# EAGLE design outputs_board_16_1_0 (EAGLE 5.07)
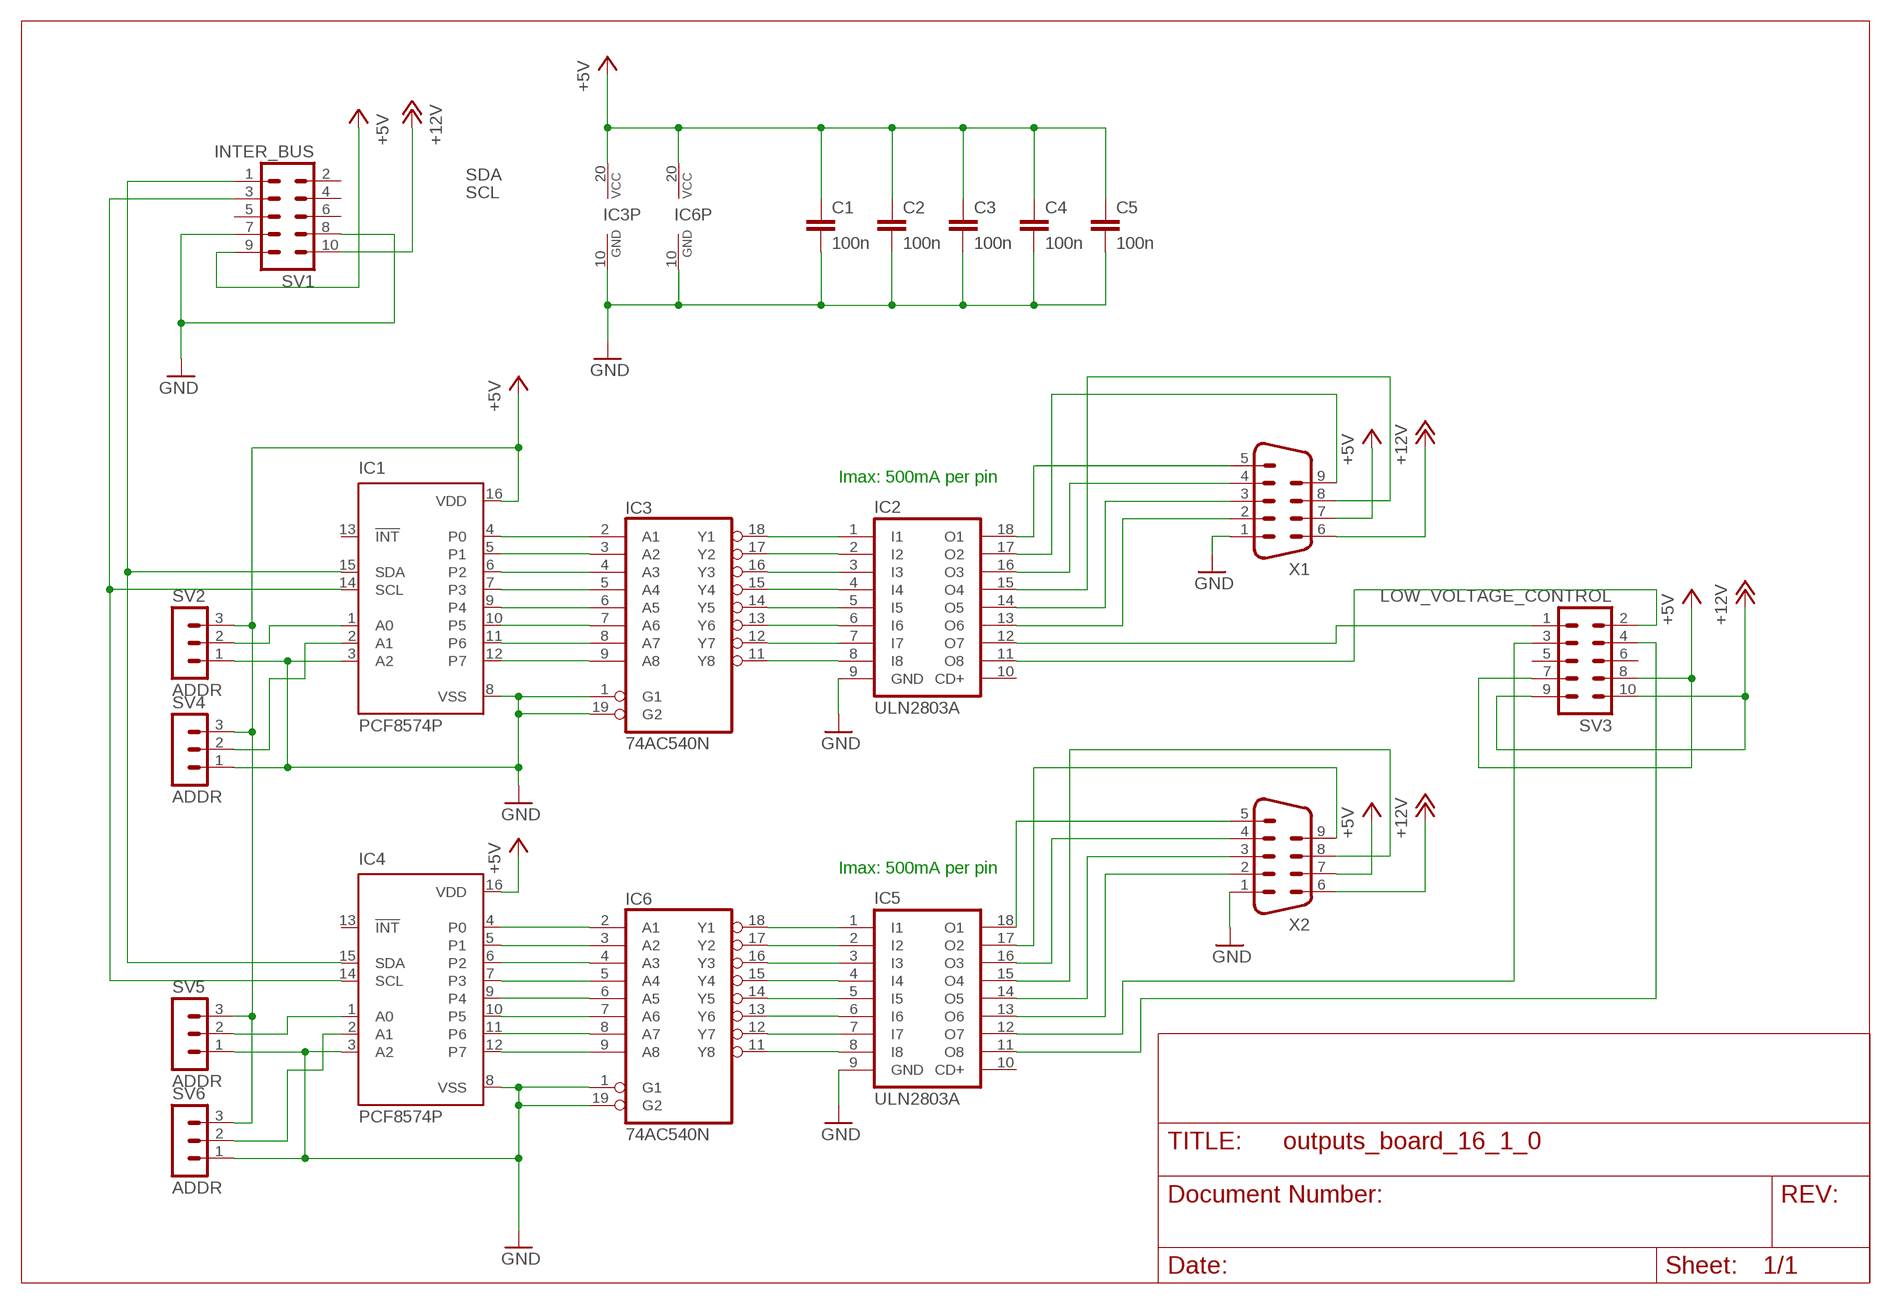
[diagram p0: schematic, sheet 1]

## Parts
C1  100n  C-EU050-024X044  [C050-024X044]
C2  100n  C-EU050-024X044  [C050-024X044]
C3  100n  C-EU050-024X044  [C050-024X044]
C4  100n  C-EU050-024X044  [C050-024X044]
C5  100n  C-EU050-024X044  [C050-024X044]
IC1  PCF8574P  [DIL16]
IC2  ULN2803A  [DIL18]
IC3  74AC540N  [DIL20]
IC4  PCF8574P  [DIL16]
IC5  ULN2803A  [DIL18]
IC6  74AC540N  [DIL20]
SV1  INTER_BUS  ML10L  [ML10L]
SV2  ADDR  MA03-1  [MA03-1]
SV3  LOW_VOLTAGE_CONTROL  ML10L  [ML10L]
SV4  ADDR  MA03-1  [MA03-1]
SV5  ADDR  MA03-1  [MA03-1]
SV6  ADDR  MA03-1  [MA03-1]
X1  M09H  [M09H]
X2  M09H  [M09H]

## Nets
+5V [power]: C1.1 C2.1 C3.1 C4.1 C5.1 IC1.16(VDD) IC3.20(VCC) IC4.16(VDD) IC6.20(VCC) SV1.9 SV2.3 SV3.7 SV3.8 SV4.3 SV5.3 SV6.3 X1.7 X2.7
+12V: SV1.10 SV3.9 SV3.10 X1.6 X2.6
GND [power]: C1.2 C2.2 C3.2 C4.2 C5.2 IC1.3(A2) IC1.8(VSS) IC2.9(GND) IC3.1(G1) IC3.10(GND) IC3.19(G2) IC4.3(A2) IC4.8(VSS) IC5.9(GND) IC6.1(G1) IC6.10(GND) IC6.19(G2) SV1.7 SV1.8 SV2.1 SV4.1 SV5.1 SV6.1 X1.1 X2.1
N$1: IC1.1(A0) SV2.2
N$2: IC1.2(A1) SV4.2
N$3: IC4.1(A0) SV5.2
N$4: IC4.2(A1) SV6.2
N$5: IC1.4(P0) IC3.2(A1)
N$6: IC1.5(P1) IC3.3(A2)
N$7: IC4.7(P3) IC6.5(A4)
N$8: IC4.6(P2) IC6.4(A3)
N$9: IC4.5(P1) IC6.3(A2)
N$10: IC4.4(P0) IC6.2(A1)
N$11: IC4.9(P4) IC6.6(A5)
N$12: IC4.10(P5) IC6.7(A6)
N$13: IC4.11(P6) IC6.8(A7)
N$14: IC4.12(P7) IC6.9(A8)
N$15: IC5.1(I1) IC6.18(Y1)
N$16: IC5.2(I2) IC6.17(Y2)
N$17: IC5.3(I3) IC6.16(Y3)
N$18: IC5.4(I4) IC6.15(Y4)
N$19: IC5.5(I5) IC6.14(Y5)
N$20: IC1.6(P2) IC3.4(A3)
N$21: IC5.6(I6) IC6.13(Y6)
N$22: IC5.7(I7) IC6.12(Y7)
N$23: IC5.8(I8) IC6.11(Y8)
N$24: IC5.18(O1) X2.5
N$25: IC5.17(O2) X2.9
N$26: IC5.16(O3) X2.4
N$27: IC5.15(O4) X2.8
N$28: IC5.14(O5) X2.3
N$29: IC1.7(P3) IC3.5(A4)
N$30: IC5.13(O6) X2.2
N$31: IC1.9(P4) IC3.6(A5)
N$32: IC1.10(P5) IC3.7(A6)
N$33: IC1.11(P6) IC3.8(A7)
N$34: IC1.12(P7) IC3.9(A8)
N$35: IC2.1(I1) IC3.18(Y1)
N$36: IC2.2(I2) IC3.17(Y2)
N$37: IC2.18(O1) X1.5
N$38: IC2.17(O2) X1.9
N$39: IC2.16(O3) X1.4
N$40: IC2.15(O4) X1.8
N$41: IC2.14(O5) X1.3
N$42: IC2.13(O6) X1.2
N$43: IC2.12(O7) SV3.1
N$44: IC2.11(O8) SV3.2
N$45: IC5.12(O7) SV3.3
N$46: IC5.11(O8) SV3.4
N$47: IC2.3(I3) IC3.16(Y3)
N$48: IC2.4(I4) IC3.15(Y4)
N$49: IC2.5(I5) IC3.14(Y5)
N$50: IC2.6(I6) IC3.13(Y6)
N$51: IC2.7(I7) IC3.12(Y7)
N$52: IC2.8(I8) IC3.11(Y8)
SCL: IC1.14(SCL) IC4.14(SCL) SV1.3
SDA: IC1.15(SDA) IC4.15(SDA) SV1.1
Unconnected: IC1.13(!INT) IC2.10(CD+) IC4.13(!INT) IC5.10(CD+) SV1.2 SV1.4 SV1.5 SV1.6 SV3.5 SV3.6

## Notes on the sheet
- Imax: 500mA per pin
- Imax: 500mA per pin

## Library data of the parts
C1-C5 = my_library:C-EU: CAPACITOR, European symbol
IC1 IC4 = micro-philips:PCF8574: I2C-Bus Remote 8-bit I/O expander http://www.semiconductors.philips.com/acrobat_download/datasheets/PCF8574_4.pdf
IC2 IC5 = uln-udn:ULN2803A: DRIVER ARRAY
IC3 IC6 = 74xx-eu:74*540: Octal BUFFER and LINE DRIVER, 3-state
SV1 SV3 = my_library:ML10L: HARTING
SV2 SV4-SV6 = con-lstb:MA03-1: PIN HEADER
X1 X2 = con-subd:M09: SUB-D

## Board
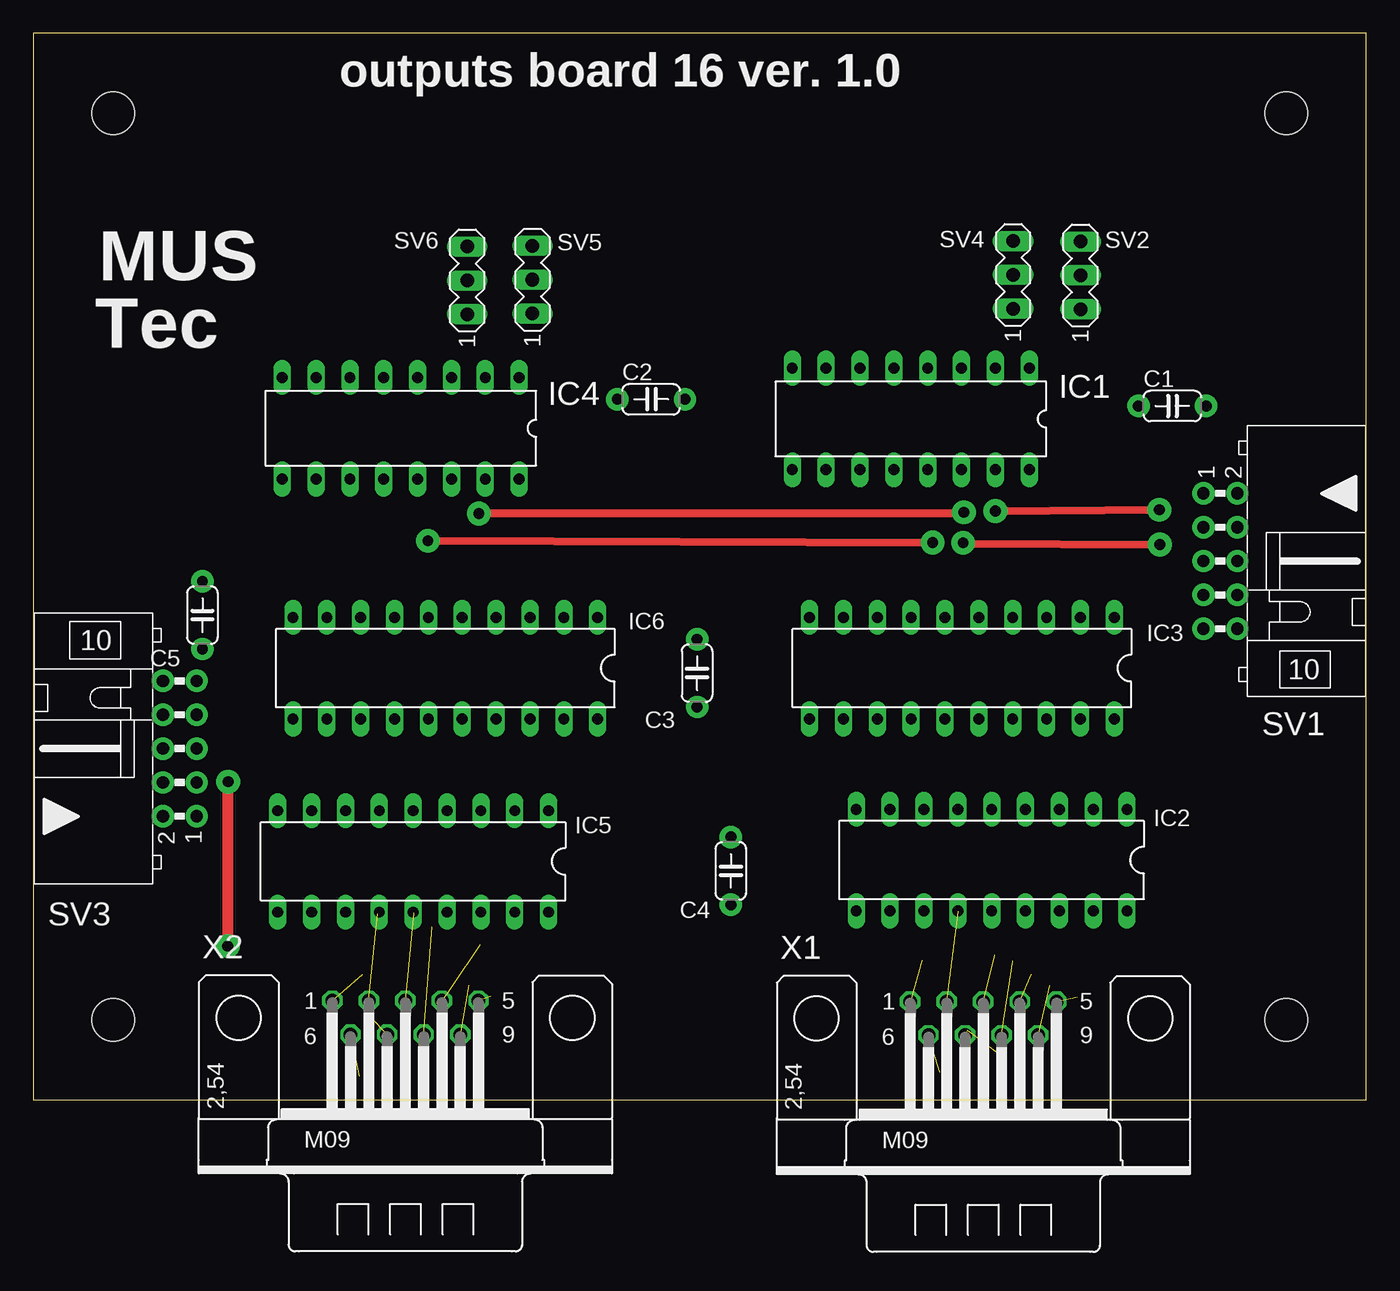
[diagram p1: board, top side]
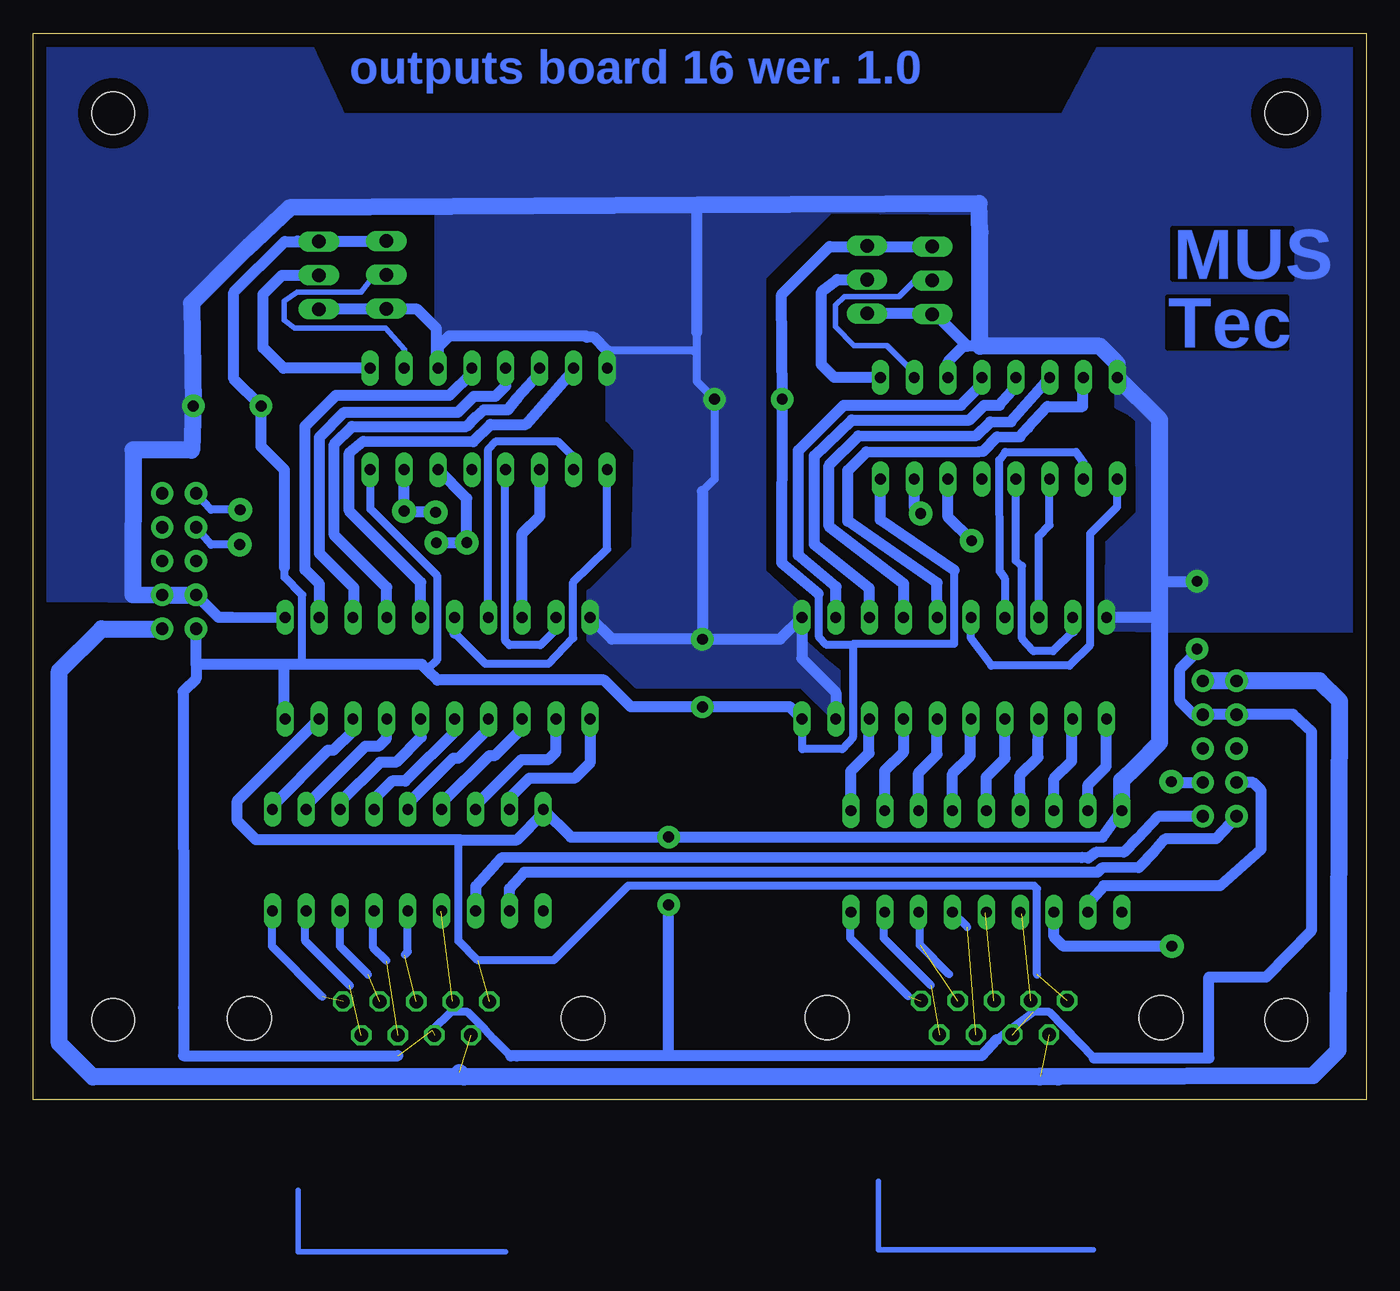
[diagram p2: board, bottom side, seen from below]

Size 100 x 80 mm. Coordinates in mm from the lower left corner, seen from the top.
Outline: 0,0 100,0 100,80 0,80 0,0
Copper layers (1*16): Top 0.035mm / dielectric 1.5mm / Bottom 0.035mm
Design rules "default *": minimum track width 10mil, minimum drill 24mil, track to track 8mil, track to pad 8mil, pad to pad 8mil, via to via 8mil, smd to smd 8mil, copper to edge 40mil, drill to drill 8mil, minimum pad ring 10mil, minimum via ring 8mil, stop-mask expansion 4mil, vias tented up to drill 0mil, thermal gap 10mil
Holes 3.2 mm at 6,74 94,74 6,6 94,6

### Footprints (pad centres in the part's own frame; a part is rotated, then mirrored left to right if it is on the bottom)
C050-024X044 = drill 0.813 pad 1.676 round: 1 -2.54,0; 2 2.54,0
DIL16 = drill 0.813 long: 1 -8.89,-3.81; 2 -6.35,-3.81; 3 -3.81,-3.81; 4 -1.27,-3.81; 5 1.27,-3.81; 6 3.81,-3.81; 7 6.35,-3.81; 8 8.89,-3.81; 9 8.89,3.81; 10 6.35,3.81; 11 3.81,3.81; 12 1.27,3.81; 13 -1.27,3.81; 14 -3.81,3.81; 15 -6.35,3.81; 16 -8.89,3.81
DIL18 = drill 0.813 long: 1 -10.16,-3.81; 2 -7.62,-3.81; 3 -5.08,-3.81; 4 -2.54,-3.81; 5 0,-3.81; 6 2.54,-3.81; 7 5.08,-3.81; 8 7.62,-3.81; 9 10.16,-3.81; 10 10.16,3.81; 11 7.62,3.81; 12 5.08,3.81; 13 2.54,3.81; 14 0,3.81; 15 -2.54,3.81; 16 -5.08,3.81; 17 -7.62,3.81; 18 -10.16,3.81
DIL20 = drill 0.813 long: 1 -11.43,-3.81; 2 -8.89,-3.81; 3 -6.35,-3.81; 4 -3.81,-3.81; 5 -1.27,-3.81; 6 1.27,-3.81; 7 3.81,-3.81; 8 6.35,-3.81; 9 8.89,-3.81; 10 11.43,-3.81; 11 11.43,3.81; 12 8.89,3.81; 13 6.35,3.81; 14 3.81,3.81; 15 1.27,3.81; 16 -1.27,3.81; 17 -3.81,3.81; 18 -6.35,3.81; 19 -8.89,3.81; 20 -11.43,3.81
ML10L = drill 0.914 pad 1.676 round: 1 -5.08,-1.27; 2 -5.08,1.27; 3 -2.54,-1.27; 4 -2.54,1.27; 5 0,-1.27; 6 0,1.27; 7 2.54,-1.27; 8 2.54,1.27; 9 5.08,-1.27; 10 5.08,1.27
MA03-1 = drill 1.016 long: 1 -2.54,0; 2 0,0; 3 2.54,0
M09H = drill 1.016 octagon: 1 -5.486,1.27; 2 -2.743,1.27; 3 0,1.27; 4 2.743,1.27; 5 5.486,1.27; 6 -4.115,-1.27; 7 -1.372,-1.27; 8 1.372,-1.27; 9 4.115,-1.27 | hole 3.302: 12.522,0; -12.522,0

### Placement (x,y rotation side)
C1  85.46,52.04 0 top
C2  46.35,52.54 0 top
C3  49.8,32 90 top
C4  52.34,17.16 90 top
C5  12.69,36.34 90 top
IC1  65.83,51.07 180 top
IC2  71.9,17.97 180 top
IC3  69.67,32.37 180 top
IC4  27.56,50.37 180 top
IC5  28.5,17.87 180 top
IC6  30.91,32.37 180 top
SV1  89.06,40.4 270 top
SV2  78.56,61.84 90 top
SV3  10.99,26.34 90 top
SV4  73.51,61.88 90 top
SV5  37.45,61.52 90 top
SV6  32.55,61.46 90 top
X1  71.27,6.09 0 top
X2  27.91,6.14 0 top

### Tracks (layer width: path | path; a pad name or v marks a point on that pad's centre or on a via)
+5V  (3 unrouted)
  Bottom 0.61: 30.9,39.7 30.9,34.19 38.44,34.19 38.51,34.12 | 38.51,34.12 38.52,27.16 39.3,26.3 42.3,26.3 42.3,28.6 | 27.74,4.51 24.97,6.58 23.79,6.58 20.4,3.1 | 38.51,34.12 40.48,34.12 41.05,34.7 41.05,37.91 41.1,37.96 | 81.15,39.92 81.15,39.19 79.82,37.86 79.82,32.66 | IC1.16 74.7,47.24 74.7,44.29 69.69,39.27 69.69,33.03 70.37,32.35 70.37,32.16 | 64.18,3.27 65.48,4.57 66.12,5.25 67.42,6.57 68.64,6.57 70.08,5.18
  Bottom 0.813: 20.4,3.1 11.8,3.1 11.8,9.2 7.5,9.2 4.1,12.7 4.1,27.6 5.5,28.9 9.69,28.9 | C3.1 43.24,29.46 IC6.20 42.3,28.6 | SV3.8 SV3.7 12.28,28.86 12.94,28.86 13.97,29.9 13.97,32.3 12.69,33.59 C5.1 | SV4.3 80.17,64.42 SV2.3 81.14,64.38 84.95,60.57 84.95,54.07 C1.1 82.92,49.01 81.15,47.24 81.15,39.92 | C3.1 49.6,29.26 | 37.39,64 SV6.3 | 37.39,64 SV5.3 | IC4.16 36.45,43.5 30.9,39.7 | 41.1,37.96 43.84,40.27 C2.1 43.86,60.41 40.27,64 37.39,64 | 52.37,3.3 28.85,3.3 27.74,4.51 | 52.37,3.3 63.73,3.27 64.18,3.27 | 72.65,3.3 88.72,3.3 88.72,6.9 88.76,30.6 87.79,31.57 87.79,32.66 | C3.1 55.16,29.46 57.17,31.47 69.68,31.47 70.37,32.16 70.87,32.66 79.82,32.66 81.2,32.66 | C4.1 52.34,3.33 52.37,3.3 | 87.79,32.66 SV1.9 | 81.2,32.66 87.79,32.66 | IC3.20 81.2,28.66 81.2,32.66
  Bottom 1.016: 9.69,28.9 SV3.8
+12V  (2 unrouted)
  Bottom 1.27: SV3.9 SV3.10 3.52,31.41 2,29.9 2.1,3.7 4,1.8 23.1,1.7 24.5,1.7 | 24.5,1.7 67.7,1.7 | 67.7,1.7 68.03,2.02 | 24.5,1.7 24.45,1.75 | SV1.10 94.89,35.32 98.05,32.16 98.05,4.21 95.54,1.7 67.7,1.7
GND  (2 unrouted)
  Bottom 0.61: 68.1,19.4 68.1,11.9 66.65,10.45 60.96,10.45 55.38,16.04 24.93,16.04 24.7,15.81 24.7,9.38 | 49.8,45.64 48.89,46.55 C2.2 50.24,53.9 50.24,55.97 | 50.24,57.55 50.24,55.97 | 56.95,56.2 50.48,56.2 50.24,55.97
  Bottom 0.813: IC3.1 85.1,36.2 86.13,36.2 SV1.7 | 73.55,59.3 SV4.1 | 73.55,59.3 73.55,59.35 | 18.34,21.66 IC5.9 19.77,19.7 20.39,19.7 C4.2 59.66,19.7 IC2.9 61.74,21.46 63.7,19.5 68,19.5 | 68,19.5 83.3,19.5 84.7,20.9 84.7,22.42 IC3.19 | 68.1,19.4 68,19.5 | IC6.19 39.8,30.56 42.35,33.11 IC6.1 43.98,34.54 C3.2 | C3.2 56.6,34.54 IC3.10 | 49.8,45.64 C3.2 | 69.64,55.49 69.64,56.45 68.8,57.29 58.56,57.29 58.46,57.19 57.94,57.19 56.95,56.2 IC1.8 | 69.64,55.49 IC1.3 | 73.55,59.3 71.19,59.3 69.75,57.85 69.75,55.6 69.64,55.49 | 73.55,59.3 SV2.1 | 50.24,57.55 50.24,67.08 50.26,67.1 | IC6.10 15.55,36.18 15.5,36.13 | 15.5,41.7 15.43,41.77 | C5.2 15.47,38.88 15.5,38.92 | IC4.3 31.37,55.37 30.21,56.53 29.93,56.53 | 28.97,56.53 29.93,56.53 | SV5.1 32.61,58.98 SV6.1 32.33,58.92 29.93,56.53
  Bottom 1.27: IC5.9 18.34,23.96 17.19,25.06 15.5,26.8 15.5,36.13 15.5,38.92 15.5,41.7 15.5,51.01 IC4.8 18.67,55.22 19.98,56.53 28.97,56.53 28.97,65.06 29.05,67.23 50.26,67.1 80.78,66.92 84.07,63.81 88.13,59.75 C1.2 88.12,48.72 92.51,48.73 92.54,37.88 SV1.8 SV1.7
  pour Bottom (no thermals): 3.54,80.25 19.28,80.18 22.71,73.7 76.79,73.7 79.68,79.91 100.02,79.91 100.02,37.71 99.32,37.58 96.7,37.65 94.39,37.6 92.65,37.55 92.95,48.96 88.67,48.86 88.35,59.42 80.83,67.21 69.63,67.18 69.63,57.26 58.01,57.29 56.82,56.1 56.82,51.07 54.7,48.82 54.85,41.29 58.13,38.03 58.24,38.03 58.24,34.57 54.7,31.14 44.15,31.14 42.33,31.14 39.74,28.59 39.72,32.1 40.93,33.1 42.36,34.36 42.33,36.82 45.3,39.55 45.29,61.76 40.22,66.76 29.09,66.64 29.18,56.89 19.95,56.76 18.63,55.3 18.64,52.08 17.81,51.66 17.07,51.06 17.01,43.93 19.31,41.69 19.4,35.41 15.2,35.35 10.17,35.35 7.63,35.35 0.23,35.35 0.13,80.18
N$1
  Bottom 0.813: SV2.2 81.34,61.84 82.77,60.41 82.77,56.42 81.22,54.88 IC1.1
N$2
  Bottom 0.406: SV4.2 74.38,61.88 75.41,60.57 80.22,60.57 81.19,59.89 81.19,58.48 80.39,57.87 73.57,57.87 72.14,56.25 72.14,54.91
  Bottom 0.813: IC1.2 72.14,54.91
N$3
  Bottom 0.813: SV5.2 39.68,61.54 40.86,60.6 40.88,55.15 39.9,54.17 IC4.1
N$4
  Bottom 0.406: 33.91,54.51 35.96,56.56 38.42,56.56 39.83,57.98 39.83,59.59 39.16,60.24 35.04,60.24 33.84,61.46 SV6.2
  Bottom 0.813: IC4.2 33.91,54.51 | SV6.2
N$5
  Bottom 0.813: IC1.4 67.1,54.51 68.77,52.84 77.29,52.84 79.62,50.52 79.62,39.76 78.54,38.68 78.54,36.2 IC3.2
N$6
  Bottom 0.813: IC1.5 64.56,53.54 65.33,52.78 66.93,52.78 68.15,51.56 76.67,51.56 78.54,49.7 78.54,40.98 75.95,38.39 75.95,36.25 IC3.3
N$7
  Bottom 0.813: IC4.7 21.27,52 23.9,52 25.38,50.42 25.98,49.74 27.69,49.72 28.72,48.66 29.06,48.61 37.5,48.6 38.9,47.2 38.9,43.4 32.2,38.76 IC6.5
N$8
  Bottom 0.813: IC4.6 26.64,50.86 28.2,50.84 29.29,49.8 29.31,49.81 38.1,49.8 40.3,47.6 40.3,43 34.7,38.7 34.7,36.2 IC6.4
N$9
  Bottom 0.813: IC4.5 26.29,53.51 27.51,52.1 28.63,52.09 28.66,52.09 29.76,50.99 38.6,51 41.4,48.3 41.4,41.65 37.28,38.35 37.3,36.22 IC6.3
N$10
  Bottom 0.813: IC4.4 28.83,53.67 30.4,52.1 39.2,52.1 42.6,48.7 42.6,40.85 39.78,38.48 IC6.2
N$11
  Bottom 0.61: IC6.6 29.64,34.61 28.13,32.55 22.26,32.55 20.7,34.11 20.7,42.47 18.68,44.49 18.68,46.55
  Bottom 0.813: 18.68,46.55 IC4.9
N$12
  Bottom 0.61: IC4.10 21.21,47.81 21.77,48.59 27.07,48.59 27.53,47.99 27.48,39.65 27.08,39.05 27.08,36.2
  Bottom 0.813: IC6.7 27.08,36.2
N$13
  Bottom 0.61: IC6.8 24.56,42.3 23.76,43.1 23.76,46.55
  Bottom 0.813: 23.76,46.55 IC4.11
N$14
  Bottom 0.61: IC4.12 26.29,40.41 25.83,40.04 25.83,34.6 24.96,33.65 23.49,33.65 22.02,35.12
  Bottom 0.813: 22.02,35.12 IC6.9
N$15
  Bottom 0.813: IC5.1 38.66,24.64 37.3,26 37.3,28.52 IC6.18
N$16
  Bottom 0.813: IC5.2 36.12,24.68 34.7,26.1 34.7,28.54 IC6.17
N$17
  Bottom 0.813: IC5.3 33.58,24.52 32.2,25.9 32.2,28.54 IC6.16
N$18
  Bottom 0.813: IC5.4 31.04,24.46 29.7,25.8 29.7,28.5 IC6.15
N$19
  Bottom 0.813: IC5.5 28.5,24.2 27.1,25.6 IC6.14
N$20
  Bottom 0.813: IC1.6 62.02,54.48 63.69,52.62 64.39,51.76 66.19,51.76 66.81,51.22 67.51,50.49 76.1,50.49 77.42,49.17 77.42,42.35 73.49,38.42 IC3.4
N$21
  Bottom 0.813: IC5.6 25.97,24.34 24.62,25.68 24.6,28.52 IC6.13
N$22
  Bottom 0.813: IC5.7 23.42,24.08 22.1,25.4 22.1,28.48 IC6.12
N$23
  Bottom 0.813: IC5.8 20.88,23.62 19.5,25 19.5,28.54 IC6.11
N$24  (1 unrouted)
  Bottom 0.61: 34.35,7.75 38.7,12.1 38.7,14.02
  Bottom 0.813: 38.7,14.02 IC5.18
N$25  (1 unrouted)
  Bottom 0.61: 32.67,8.57 36.2,12.1 36.2,13.98
  Bottom 0.813: 36.2,13.98 IC5.17
N$26  (1 unrouted)
  Bottom 0.61: 31.3,9.4 33.5,11.6 33.5,13.98
  Bottom 0.813: 33.5,13.98 IC5.16
N$27  (1 unrouted)
  Bottom 0.61: 29.93,12.95 IC5.15
N$28  (1 unrouted)
  Bottom 0.813: IC5.14 28.56,14
N$29
  Bottom 0.813: IC1.7 59.48,54.72 63.03,50.65 65.7,50.65 67,49.35 75.23,49.39 76.3,48.51 76.3,44.17 70.93,38.81 IC3.5
N$30  (1 unrouted)
  Bottom 0.813: IC5.13 25.82,13.92
N$31
  Bottom 0.61: IC1.9 56.94,41.29 59.49,38.82 59.49,34.62 61.35,32.68 66.07,32.68 68.38,35
  Bottom 0.813: 68.38,35 68.38,36.16 IC3.6
N$32
  Bottom 0.61: 59.48,48.2 60.69,49.4 65.27,49.4 65.88,48.79 65.88,36.2
  Bottom 0.813: 59.48,48.2 IC1.10 | IC3.7 65.88,36.2
N$33
  Bottom 0.813: IC3.8 63.32,42.48 62,43.8 62,47.24 IC1.11
N$34
  Bottom 0.61: 64.61,47.22 64.61,34.43 64.27,34.1 61.96,34.1 60.78,35.28
  Bottom 0.813: 64.61,47.22 IC1.12 | 60.78,35.28 IC3.9
N$35
  Bottom 0.813: IC2.1 82.06,22.04 77.9,26.2 77.5,26.2 76.1,27.6 76.1,28.48 IC3.18
N$36
  Bottom 0.813: IC2.2 79.52,22.08 75.1,26.5 74.1,26.5 73.5,27.1 73.5,28.54 IC3.17
N$37  (1 unrouted)
  Bottom 0.61: 78.32,7.72 82.1,11.5 82.1,14.12
  Bottom 0.813: 82.1,14.12 IC2.18
N$38  (1 unrouted)
  Bottom 0.61: 76.25,8.55 79.6,11.9 79.6,14.08
  Bottom 0.813: 79.6,14.08 IC2.17
N$39  (1 unrouted)
  Bottom 0.61: 74.88,9.38 77,11.5 77,14.14
  Bottom 0.813: 77,14.14 IC2.16
N$40  (1 unrouted)
  Bottom 0.61: 73.51,10.41 74.5,11.4 74.5,14.1
  Bottom 0.813: 74.5,14.1 IC2.15
N$41  (1 unrouted)
  Bottom 0.61: 72.14,10.86 71.9,11.1 IC2.14
N$42  (1 unrouted)
  Bottom 0.813: IC2.13 69.4,14.12
N$43
  Bottom 0.813: IC2.12 66.8,14.18 66.8,16.01 64.89,18.13 21.34,18.15 20.86,18.13 20.23,18.57 18.19,18.56 17.15,19.6 15.63,21.23 12.29,21.23 SV3.1
N$44
  Bottom 0.813: SV3.2 11.28,19.56 15.09,19.55 15.95,18.58 17.06,17.41 19.85,17.37 20.16,17.05 20.45,17.05 63.17,17.05 64.3,15.82 64.3,14.18 IC2.11
N$45  (via drill 0.8 pad 1.78)
  Top 0.813: v14.62,23.84 14.62,11.54 v14.58,11.5
  Bottom 0.813: SV3.3 14.57,23.8 v14.62,23.84 | v14.58,11.5 22.7,11.5 23.42,12.22 IC5.12
N$46
  Bottom 0.813: IC5.11 20.88,14.66 19.7,16.05 10.95,16.05 7.87,18.78 7.87,23.19 8.47,23.79 SV3.4
N$47
  Bottom 0.813: IC2.3 76.98,22.32 74,25.3 72.8,25.3 70.9,27.2 70.9,28.52 IC3.16
N$48
  Bottom 0.813: IC2.4 74.44,22.56 73.1,23.9 72.1,23.9 68.3,27.7 68.3,28.46 IC3.15
N$49
  Bottom 0.813: IC2.5 71.9,22.2 68.5,25.6 68.1,25.6 65.8,27.9 65.8,28.5 IC3.14
N$50
  Bottom 0.813: IC2.6 69.36,22.24 65.8,25.8 65.4,25.8 63.3,27.9 63.3,28.54 IC3.13
N$51
  Bottom 0.813: IC2.7 66.82,22.08 63.4,25.5 61.4,25.5 60.8,26.1 60.8,28.54 IC3.12
N$52
  Bottom 0.813: IC2.8 64.28,22.62 62.8,24.1 59.4,24.1 58.2,25.3 58.2,28.52 IC3.11
N$53
  Bottom 0.406: 20.45,-11.28 36.6,-11.28 36.6,-6.13
N$54
  Bottom 0.406: 64.56,-11.42 80.15,-11.42 80.15,-6.82
SCL  (via drill 0.8 pad 1.78)
  Top 0.61: v29.6,41.93 v67.47,41.79 | 69.64,41.71 v84.52,41.64
  Top 0.813: v69.75,41.77 69.64,41.71
  Bottom 0.61: v84.52,41.64 86.66,41.64 SV1.3
  Bottom 0.813: IC4.14 31.37,43.7 v29.6,41.93 | IC1.14 67.49,45.11 67.49,41.93 v67.47,41.79 67.52,41.77 v69.75,41.77
SDA  (via drill 0.8 pad 1.78)
  Top 0.61: 33.42,44.02 69.77,44.02 | v72.18,44.16 v84.48,44.26
  Top 0.813: v33.42,43.97 33.42,44.02 | 69.77,44.02 v69.82,44.06
  Bottom 0.61: v84.48,44.26 86.67,44.26 SV1.1
  Bottom 0.813: IC4.15 33.91,44.46 v33.42,43.97 | v69.82,44.06 72.09,44.06 v72.18,44.16 IC1.15
(copper drawn outside any net)
  shapes: Bottom circle x4

### Text on the board
Bottom: outputs board 16 wer. 1.0 | MUS | Tec
tPlace: Tec
tNames: outputs board 16 ver. 1.0 | MUS